# Altium schematic sheet Sheet_象鼻吸盘电源电路_2025-11-01.schdoc
size 301 x 201 mm
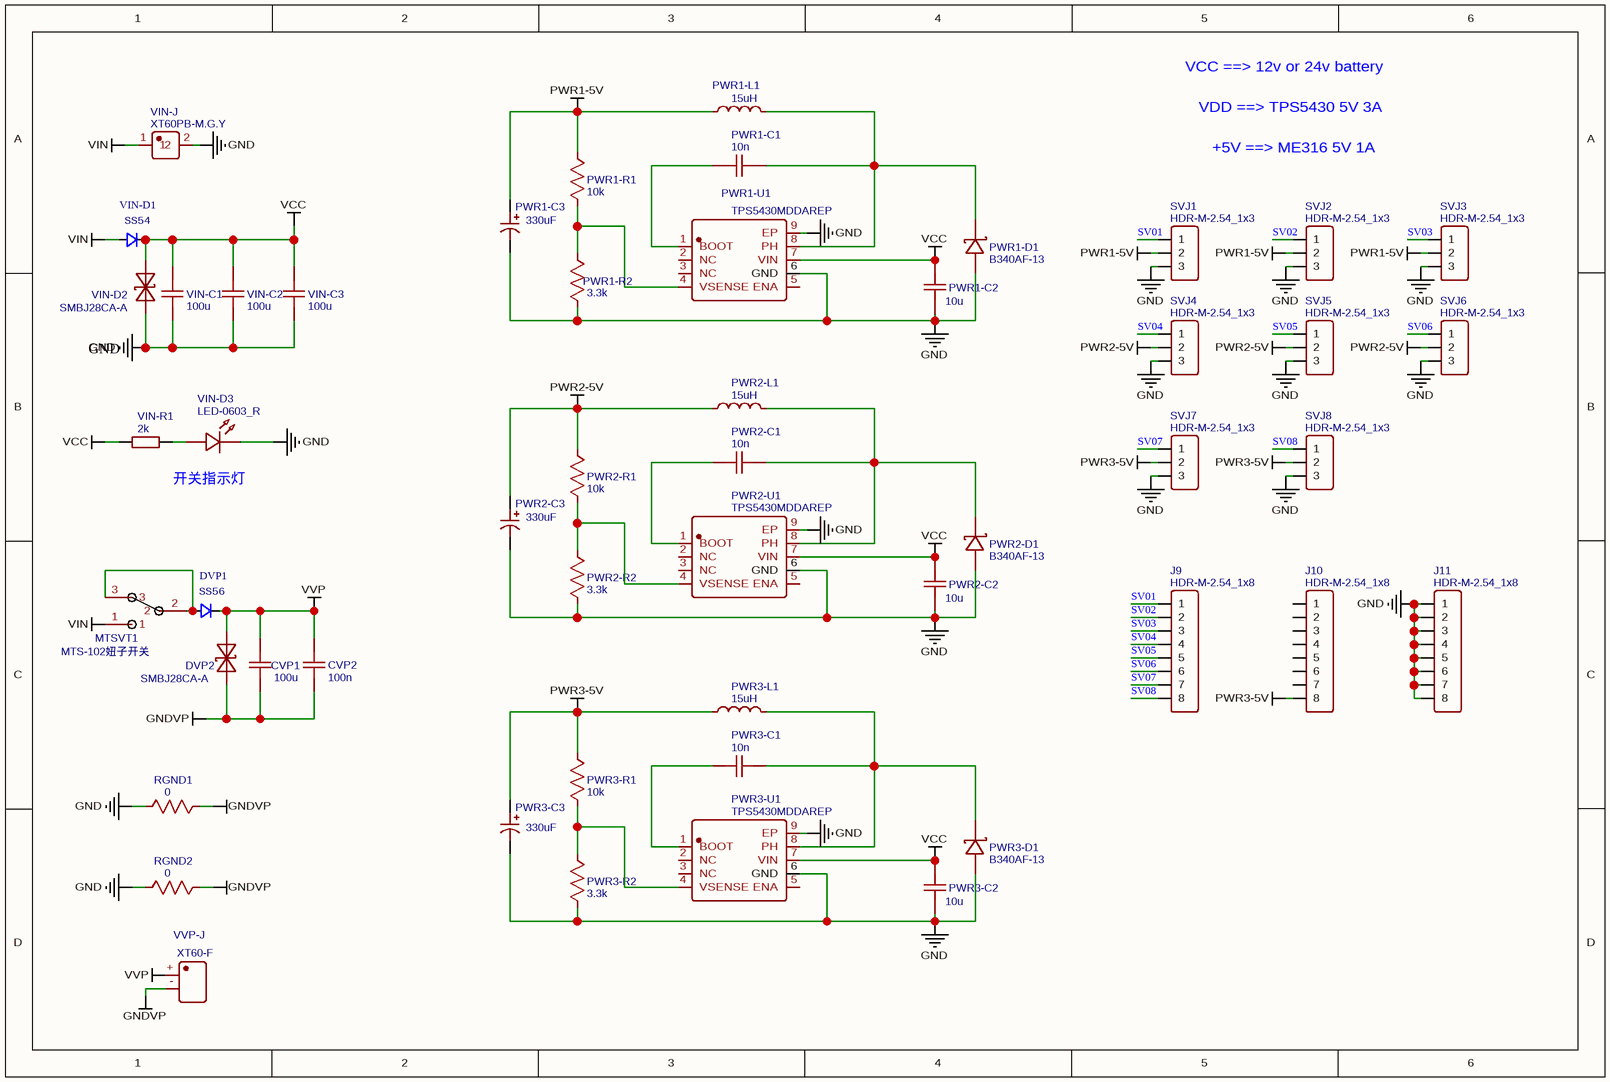
[diagram p0: Sheet_象鼻吸盘电源电路_2025-11-01.schdoc]

## Parts
CVP1  100u  [0603_DIY]
CVP2  100n  [0603_DIY]
DVP1  SS56  [SS56]
DVP2  SMBJ28CA-A  [SMBJ28]
J9  HDR-M-2.54_1x8  [HDR-M-2.54_1X8]
J10  HDR-M-2.54_1x8  [HDR-M-2.54_1X8]
J11  HDR-M-2.54_1x8  [HDR-M-2.54_1X8]
MTSVT1  MTS-102妞子开关  [MTS102]
PWR1-C1  10n  [0603_DIY]
PWR1-C2  10u  [0603_DIY]
PWR1-C3  330uF  [CAP-SMD_BD8.0-L8.3-W8.3-LS9.3-FD-2]
PWR1-D1  B340AF-13  [SMAF_L3.5-W2.6-LS4.7-RD]
PWR1-L1  15uH  [IND-SMD_L10.0-W10.0_MDA1050-3R3M]
PWR1-R1  10k  [0603_DIY]
PWR1-R2  3.3k  [0603_DIY]
PWR1-U1  TPS5430MDDAREP  [POWERPAD-SO-8_L4.9-W3.9-P1.27-LS6.0-BL-EP]
PWR2-C1  10n  [0603_DIY]
PWR2-C2  10u  [0603_DIY]
PWR2-C3  330uF  [CAP-SMD_BD8.0-L8.3-W8.3-LS9.3-FD-2]
PWR2-D1  B340AF-13  [SMAF_L3.5-W2.6-LS4.7-RD]
PWR2-L1  15uH  [IND-SMD_L10.0-W10.0_MDA1050-3R3M]
PWR2-R1  10k  [0603_DIY]
PWR2-R2  3.3k  [0603_DIY]
PWR2-U1  TPS5430MDDAREP  [POWERPAD-SO-8_L4.9-W3.9-P1.27-LS6.0-BL-EP]
PWR3-C1  10n  [0603_DIY]
PWR3-C2  10u  [0603_DIY]
PWR3-C3  330uF  [CAP-SMD_BD8.0-L8.3-W8.3-LS9.3-FD-2]
PWR3-D1  B340AF-13  [SMAF_L3.5-W2.6-LS4.7-RD]
PWR3-L1  15uH  [IND-SMD_L10.0-W10.0_MDA1050-3R3M]
PWR3-R1  10k  [0603_DIY]
PWR3-R2  3.3k  [0603_DIY]
PWR3-U1  TPS5430MDDAREP  [POWERPAD-SO-8_L4.9-W3.9-P1.27-LS6.0-BL-EP]
RGND1  0  [0603_DIY]
RGND2  0  [0603_DIY]
SVJ1  HDR-M-2.54_1x3  [HDR-M-2.54_1X3]
SVJ2  HDR-M-2.54_1x3  [HDR-M-2.54_1X3]
SVJ3  HDR-M-2.54_1x3  [HDR-M-2.54_1X3]
SVJ4  HDR-M-2.54_1x3  [HDR-M-2.54_1X3]
SVJ5  HDR-M-2.54_1x3  [HDR-M-2.54_1X3]
SVJ6  HDR-M-2.54_1x3  [HDR-M-2.54_1X3]
SVJ7  HDR-M-2.54_1x3  [HDR-M-2.54_1X3]
SVJ8  HDR-M-2.54_1x3  [HDR-M-2.54_1X3]
VIN-C1  100u  [0603_DIY]
VIN-C2  100u  [0603_DIY]
VIN-C3  100u  [0603_DIY]
VIN-D1  SS54  [DO-214AC]
VIN-D2  SMBJ28CA-A  [SMBJ28]
VIN-D3  LED-0603_R  [LED0603_RED]
VIN-J  XT60PB-M.G.Y  [CONN-TH_XT60PB-M]
VIN-R1  2k  [0603_DIY]
VVP-J  XT60-F  [CONN-TH_XT60PB-F]

## Nets
GND: J11.1 J11.2 J11.3 J11.4 J11.5 J11.6 J11.7 J11.8 PWR1-C2.2 PWR1-C3.2 PWR1-D1.2(A) PWR1-R2.1 PWR1-U1.6(GND) PWR1-U1.9(EP) PWR2-C2.2 PWR2-C3.2 PWR2-D1.2(A) PWR2-R2.1 PWR2-U1.6(GND) PWR2-U1.9(EP) PWR3-C2.2 PWR3-C3.2 PWR3-D1.2(A) PWR3-R2.1 PWR3-U1.6(GND) PWR3-U1.9(EP) RGND1.1 RGND2.1 SVJ1.3 SVJ2.3 SVJ3.3 SVJ4.3 SVJ5.3 SVJ6.3 SVJ7.3 SVJ8.3 VIN-C1.1 VIN-C2.1 VIN-C3.1 VIN-D2.2 VIN-D3.2 VIN-J.2
GNDVP: CVP1.1 CVP2.1 DVP2.2 RGND1.2 RGND2.2 VVP-J.-
PWR1-5V: PWR1-C3.1 PWR1-L1.1 PWR1-R1.2 SVJ1.2 SVJ2.2 SVJ3.2
PWR2-5V: PWR2-C3.1 PWR2-L1.1 PWR2-R1.2 SVJ4.2 SVJ5.2 SVJ6.2
PWR3-5V: J10.8 PWR3-C3.1 PWR3-L1.1 PWR3-R1.2 SVJ7.2 SVJ8.2
VCC: PWR1-C2.1 PWR1-U1.7(VIN) PWR2-C2.1 PWR2-U1.7(VIN) PWR3-C2.1 PWR3-U1.7(VIN) VIN-C1.2 VIN-C2.2 VIN-C3.2 VIN-D1.1(K) VIN-D2.1 VIN-R1.2
VIN: MTSVT1.1 VIN-D1.2(A) VIN-J.1
VVP: CVP1.2 CVP2.2 DVP1.1(K) DVP2.1 VVP-J.+
SV01: J9.1 SVJ1.1
SV02: J9.2 SVJ2.1
SV03: J9.3 SVJ3.1
SV04: J9.4 SVJ4.1
SV05: J9.5 SVJ5.1
SV06: J9.6 SVJ6.1
SV07: J9.7 SVJ7.1
SV08: J9.8 SVJ8.1
NetDVP1_2: DVP1.2(A) MTSVT1.2 MTSVT1.3
NetPWR1-C1_1: PWR1-C1.1 PWR1-U1.1(BOOT)
NetPWR1-C1_2: PWR1-C1.2 PWR1-D1.1(C) PWR1-L1.2 PWR1-U1.8(PH)
NetPWR1-R1_1: PWR1-R1.1 PWR1-R2.2 PWR1-U1.4(VSENSE)
NetPWR2-C1_1: PWR2-C1.1 PWR2-U1.1(BOOT)
NetPWR2-C1_2: PWR2-C1.2 PWR2-D1.1(C) PWR2-L1.2 PWR2-U1.8(PH)
NetPWR2-R1_1: PWR2-R1.1 PWR2-R2.2 PWR2-U1.4(VSENSE)
NetPWR3-C1_1: PWR3-C1.1 PWR3-U1.1(BOOT)
NetPWR3-C1_2: PWR3-C1.2 PWR3-D1.1(C) PWR3-L1.2 PWR3-U1.8(PH)
NetPWR3-R1_1: PWR3-R1.1 PWR3-R2.2 PWR3-U1.4(VSENSE)
NetVIN-D3_1: VIN-D3.1 VIN-R1.1

Not connected (* = marked no-connect by the designer): J10 1 2 3 4 5 6 7; PWR1-U1 2(NC) 3(NC) 5(ENA); PWR2-U1 2(NC) 3(NC) 5(ENA); PWR3-U1 2(NC) 3(NC) 5(ENA)

## Notes on the sheet
- VCC ==> 12v or 24v battery
- VDD ==> TPS5430 5V 3A
- +5V ==> ME316 5V 1A
- GND
- 开关指示灯

## Library data of the parts
CVP1 VIN-C1-VIN-C3 = 100u: nameAlias: Value(F); Contributor: LCEDA_Lib; spicePre: C; spiceSymbolName: C_1206_US
CVP2 = 100n: nameAlias: Value(F); Contributor: LCEDA_Lib; spicePre: C; spiceSymbolName: C_1206_US
DVP2 VIN-D2 = SMBJ28CA-A: Manufacturer: SMC(Sangdest Microelectronicstronic (Nanjing)); Contributor: MRTAN; Supplier: LCSC; Supplier Part: C492918; Manufacturer Part: SMBJ28CA-A; JLCPCB Part Class: Extended Part; spicePre: D; spiceSymbolName: SMBJ28CA-A
J9-J11 = HDR-M-2.54_1x8: Contributor: LCEDA_Lib; Supplier Part: C190820; Supplier: LCSC; spicePre: J; spiceSymbolName: HDR-M-2.54_1x8
MTSVT1 = MTS-102妞子开关: Contributor: qingxiaobai; spicePre: U; spiceSymbolName: MTS-102妞子开关
PWR1-C1 PWR2-C1 PWR3-C1 = 10n: nameAlias: Value(F); Contributor: LCEDA_Lib; spicePre: C; spiceSymbolName: C_0603_US
PWR1-C2 PWR2-C2 PWR3-C2 = 10u: nameAlias: Value(F); Contributor: LCEDA_Lib; spicePre: C; spiceSymbolName: C_0603_US
PWR1-C3 PWR2-C3 PWR3-C3 = 330uF: Manufacturer: DMBJ(振宝佳); Manufacturer Part: RVT1C331M0810 330UF 16V; nameAlias: Value; Contributor: lcsc; Supplier: LCSC; Supplier Part: C970700; JLCPCB Part Class: Extended Part; spicePre: C; spiceSymbolName: RVT1C331M0810 330UF 16V
PWR1-D1 PWR2-D1 PWR3-D1 = B340AF-13: Manufacturer: DIODES(美台); Contributor: LCSC; Supplier Part: C172880; Supplier: LCSC; Manufacturer Part: B340AF-13; JLCPCB Part Class: Extended Part; spicePre: D; spiceSymbolName: B340AF-13
PWR1-L1 PWR2-L1 PWR3-L1 = 15uH: Manufacturer: KOHERelec(科或); Manufacturer Part: MDA1050-150M; Contributor: lcsc; nameAlias: Value; Supplier: LCSC; Supplier Part: C2847564; JLCPCB Part Class: Extended Part; spicePre: U; spiceSymbolName: MDA1050-150M
PWR1-R1 PWR2-R1 PWR3-R1 = 10k: nameAlias: Value(Ω); Contributor: LCEDA_Lib; spicePre: R; spiceSymbolName: R_0603_US
PWR1-R2 PWR2-R2 PWR3-R2 = 3.3k: nameAlias: Value(Ω); Contributor: LCEDA_Lib; spicePre: R; spiceSymbolName: R_0603_US
PWR1-U1 PWR2-U1 PWR3-U1 = TPS5430MDDAREP: Manufacturer: TI(德州仪器); Contributor: LCSC; Supplier: LCSC; Supplier Part: C2070712; Manufacturer Part: TPS5430MDDAREP; JLCPCB Part Class: Extended Part; spicePre: U; spiceSymbolName: TPS5430MDDAREP
RGND1 RGND2 = 0: nameAlias: Value(Ω); Contributor: LCEDA_Lib; spicePre: R; spiceSymbolName: R_0402_US
SVJ1-SVJ8 = HDR-M-2.54_1x3: Contributor: LCEDA_Lib; Supplier Part: C180248; Supplier: LCSC; spicePre: J; spiceSymbolName: HDR-M-2.54_1x3
VIN-D3 = LED-0603_R: Manufacturer: EVERLIGHT(台湾亿光); Manufacturer Part: 19-217/R6C-AL1M2VY/3T; Contributor: LCEDA_01; Supplier Part: C72044; Supplier: LCSC; spicePre: L; spiceSymbolName: LED-0603_R
VIN-J = XT60PB-M.G.Y: Manufacturer: AMASS(艾迈斯); Contributor: lcsc; Supplier: LCSC; Supplier Part: C19268037; Manufacturer Part: XT60PB-M.G.Y; JLCPCB Part Class: Extended Part; spicePre: U; spiceSymbolName: XT60PB-M.G.Y
VIN-R1 = 2k: Manufacturer: UniOhm; Manufacturer Part: 0603WAF4701T5E; nameAlias: Resistance; Resistance (Ohms): 4.7K; Supplier: LCSC; Supplier Part: C23162; JLCPCB Part Class: Basic Part; spicePre: R; spiceSymbolName: 0603WAF4701T5E
VVP-J = XT60-F: Manufacturer: AMASS(艾迈斯); Contributor: lcsc; Supplier: LCSC; Supplier Part: C98734; Manufacturer Part: XT60-F; JLCPCB Part Class: Extended Part; spicePre: U; spiceSymbolName: XT60-F
DVP1 = SS56: Type: SMA
VIN-D1 = SS54: Type: SMA